# Altium schematic sheet Main.SchDoc
size A4
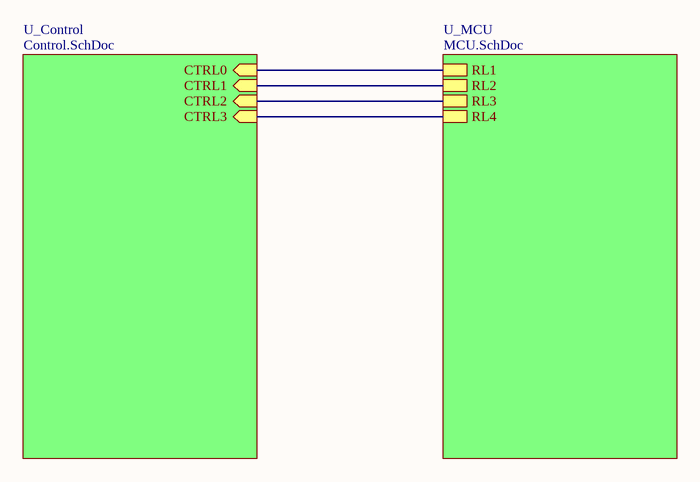
[diagram p0: Main.SchDoc]

## Sub-sheets
U_Control = Control.SchDoc: CTRL0 (in), CTRL2 (in), CTRL1 (in), CTRL3 (in)
U_MCU = MCU.SchDoc: RL1, RL2, RL3, RL4

## Nets
(unnamed): sheet U_MCU/RL1, sheet U_Control/CTRL0
(unnamed): sheet U_MCU/RL2, sheet U_Control/CTRL1
(unnamed): sheet U_MCU/RL3, sheet U_Control/CTRL2
(unnamed): sheet U_MCU/RL4, sheet U_Control/CTRL3